# EAGLE design CrabTimerPot (EAGLE 7.6.0)
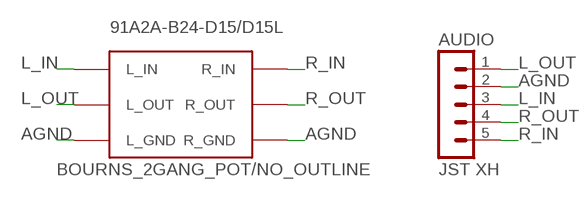
[diagram p0: schematic, sheet 1]

## Parts
AUDIO  JST XH  JST-B5B-XH-A  [B5B-XH-A]
U$1  BOURNS_2GANG_POT/NO_OUTLINE  [BOURNS_2GANG_POT/NO_OUTLINE]

## Nets
AGND: AUDIO.2 U$1.L_GND U$1.R_GND
L_IN: AUDIO.3 U$1.L_IN
L_OUT: AUDIO.1 U$1.L_OUT
R_IN: AUDIO.5 U$1.R_IN
R_OUT: AUDIO.4 U$1.R_OUT

## Library data of the parts
AUDIO = mylibrary:JST-B5B-XH-A: JST Connector (2.5 mm / 0.1 in) - 5 Circuit / Top Entry
U$1 = mylibrary:BOURNS_2GANG_POT/NO_OUTLINE

## Net classes
0 default: width 0.406 mm, clearance 0.635 mm

## Board
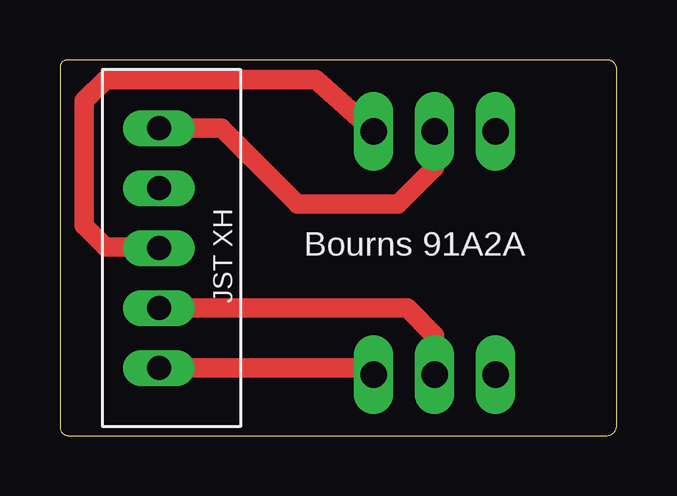
[diagram p1: board, top side]
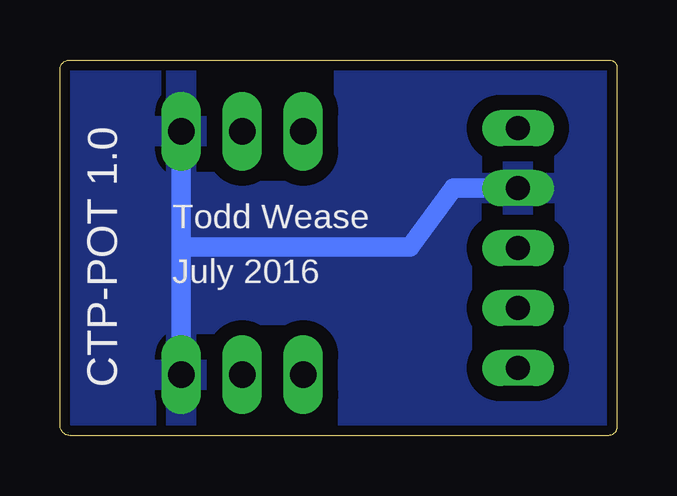
[diagram p2: board, bottom side, seen from below]

Size 23.22 x 15.67 mm. Coordinates in mm from the lower left corner, seen from the top.
Outline: 0,15.36 0,0.36 arc90 0.36,0 22.78,0 arc90 23.22,0.44 23.22,15.27 arc90 22.82,15.67 0.31,15.67 arc90 0,15.36
Copper layers (1*16): Top 0.0356mm / dielectric 1.5011mm / Bottom 0.0356mm
Design rules "oshpark-2layer": minimum track width 6mil, minimum drill 13mil, track to track 6mil, track to pad 6mil, pad to pad 6mil, via to via 6mil, smd to smd 6mil, copper to edge 15mil, drill to drill 6mil, minimum pad ring 7mil, minimum via ring 7mil, stop-mask expansion 2.5mil, vias tented up to drill 0mil, thermal gap 10mil

### Footprints (pad centres in the part's own frame; a part is rotated, then mirrored left to right if it is on the bottom)
B5B-XH-A = drill 1 long: 1 0.95,-1.65; 2 0.95,-4.15; 3 0.95,-6.65; 4 0.95,-9.15; 5 0.95,-11.65
BOURNS_2GANG_POT/NO_OUTLINE = drill 1.1 long: L_GND 2.54,5.08; L_IN -2.54,5.08; L_OUT 0,5.08; R_GND 2.54,-5.08; R_IN -2.54,-5.08; R_OUT 0,-5.08

### Placement (x,y rotation side)
AUDIO  3.17,14.48 0 top
U$1  15.62,7.62 0 top

### Tracks (layer width: path | path; a pad name or v marks a point on that pad's centre or on a via)
AGND
  Bottom 0.813: AUDIO.2 6.82,10.33 8.64,7.87 18.16,7.87 | 18.16,7.87 U$1.L_GND | 18.16,7.87 U$1.R_GND
  pour Bottom (isolate 0.406): 0.13,15.49 22.99,15.49 22.99,0.25 0.13,0.25
L_IN
  Top 0.813: U$1.L_IN 10.67,14.86 1.91,14.86 1.02,13.97 1.02,8.76 1.91,7.87 4.08,7.87 AUDIO.3
L_OUT
  Top 0.813: U$1.L_OUT 15.62,11.18 14.1,9.65 9.91,9.65 6.73,12.83 AUDIO.1
R_IN
  Top 0.813: AUDIO.5 12.79,2.83 U$1.R_IN
R_OUT
  Top 0.813: AUDIO.4 14.48,5.33 15.62,4.19 U$1.R_OUT

### Text on the board
tNames: Bourns 91A2A
bNames: Todd Wease | July 2016 | CTP-POT 1.0